# Altium schematic sheet NE-CurrentSense-V2.SchDoc: Current Sense
size A4; Organization: Altium Limited; Address1: L3, 12a Rodborough Rd; Address2: Frenchs Forest; Address3: NSW; Address4: Australia 2086; Revision: 2.0; SheetNumber: 1; SheetTotal: 1
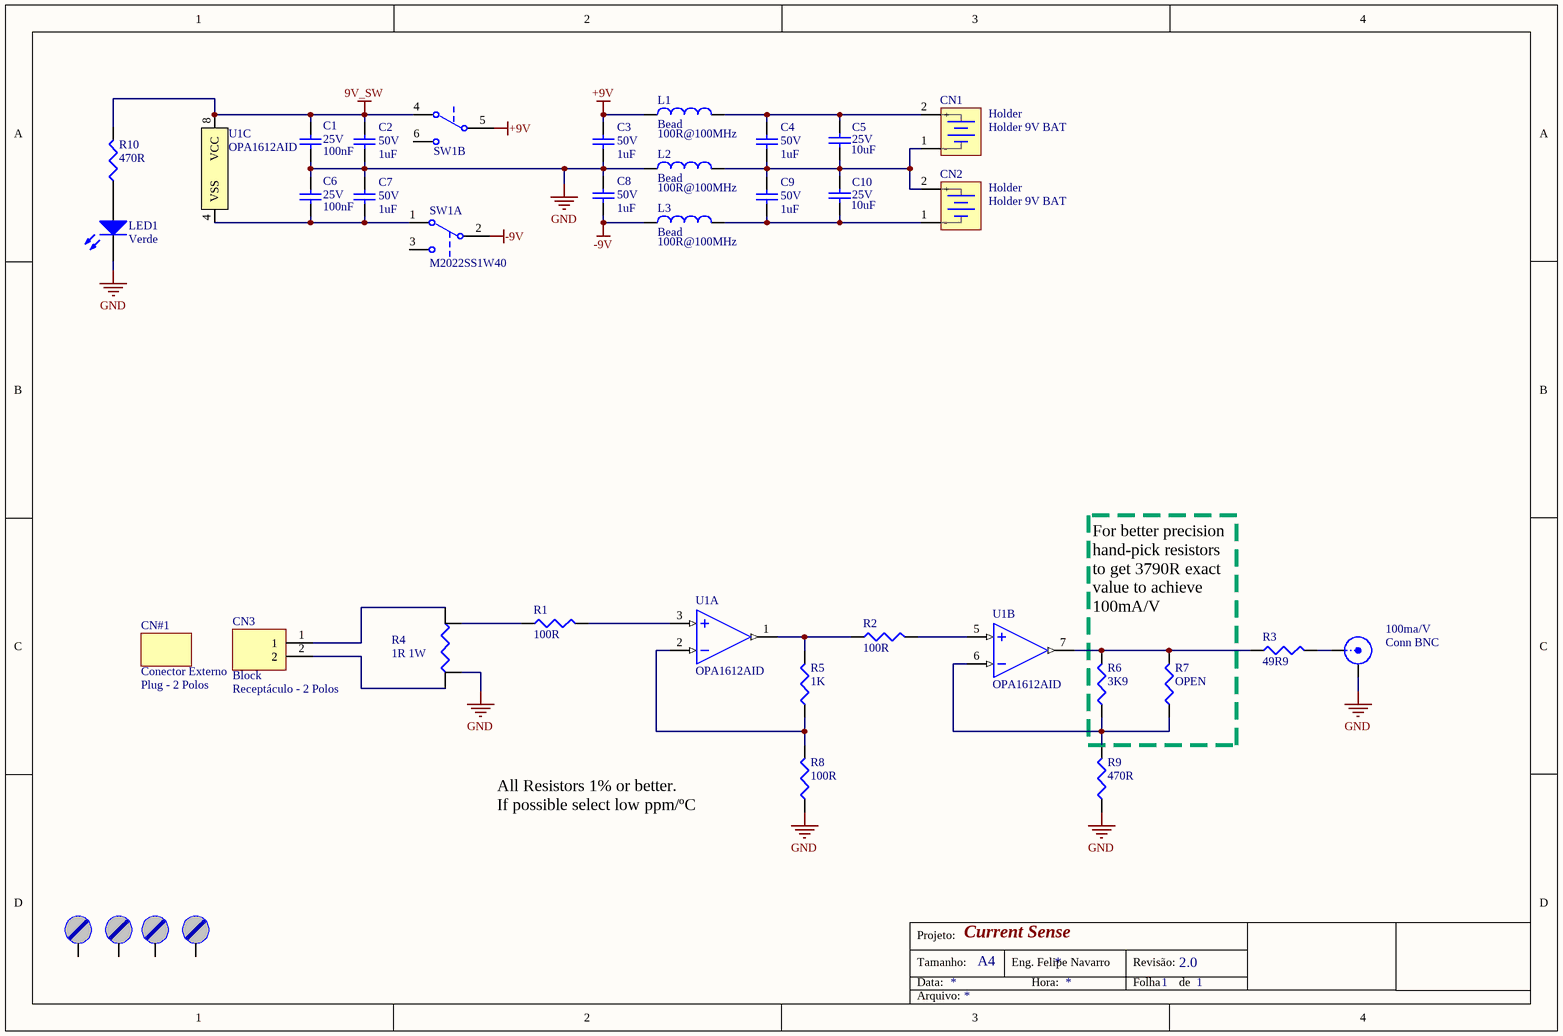
[diagram p0: NE-CurrentSense-V2.SchDoc]

## Parts
(Parts that share a designator on the sheet are numbered #1, #2 ... from top to bottom, then left to right.)
100ma/V  Conn BNC  [CONN BNC-JACK]
C1  value 100nF  Tensão: 25V  [CC0603]  (hidden comment: Capacitor Cerâmico)
C2  value 1uF  Tensão: 50V  [CC0603]  (hidden comment: Capacitor Cerâmico)
C3  value 1uF  Tensão: 50V  [CC0603]  (hidden comment: Capacitor Cerâmico)
C4  value 1uF  Tensão: 50V  [CC0603]  (hidden comment: Capacitor Cerâmico)
C5  value 10uF  Tensão: 25V  [CC0805]  (hidden comment: Capacitor Cerâmico)
C6  value 100nF  Tensão: 25V  [CC0603]  (hidden comment: Capacitor Cerâmico)
C7  value 1uF  Tensão: 50V  [CC0603]  (hidden comment: Capacitor Cerâmico)
C8  value 1uF  Tensão: 50V  [CC0603]  (hidden comment: Capacitor Cerâmico)
C9  value 1uF  Tensão: 50V  [CC0603]  (hidden comment: Capacitor Cerâmico)
C10  value 10uF  Tensão: 25V  [CC0805]  (hidden comment: Capacitor Cerâmico)
CN1  Holder  value Holder 9V BAT  [BATTHOLDER-9V-BH9V-PC-ND]
CN2  Holder  value Holder 9V BAT  [BATTHOLDER-9V-BH9V-PC-ND]
CN3  Block  value Receptáculo - 2 Polos  [CONN BLOCK2 RCPT/H]
CN#1  Conector Externo  value Plug - 2 Polos  [N/A]
HOLE3  Furo de Fixação  [Furo_M3]  (value not drawn)  (no BOM)
HOLE4#1  Furo de Fixação  [Furo_M3]  (value not drawn)  (no BOM)
HOLE4#2  Furo de Fixação  [Furo_M3]  (value not drawn)  (no BOM)
HOLE5  Furo de Fixação  [Furo_M3]  (value not drawn)  (no BOM)
L1  Bead  value 100R@100MHz  [CC0603]
L2  Bead  value 100R@100MHz  [CC0603]
L3  Bead  value 100R@100MHz  [CC0603]
LED1  value Verde  [LED-INDIC]  (hidden comment: LED)
R1  value 100R  [CC0603]  (hidden comment: Resistor)
R2  value 100R  [CC0603]  (hidden comment: Resistor)
R3  value 49R9  [CC0603]  (hidden comment: Resistor)
R4  value 1R 1W  [CC2516 - Wide Vishay]  (hidden comment: Resistor)
R5  value 1K  [CC0603]  (hidden comment: Resistor)
R6  value 3K9  [CC0603]  (hidden comment: Resistor)
R7  value OPEN  [CC0603]  (hidden comment: Resistor Open)  (no BOM)
R8  value 100R  [CC0603]  (hidden comment: Resistor)
R9  value 470R  [CC0603]  (hidden comment: Resistor)
R10  value 470R  [CC0603]  (hidden comment: Resistor)
SW1  M2022SS1W40  [SWITCH TOGGLE DPDT 6A 125V]  (parts A,B of 2)
U1  OPA1612AID  [SOIC-8N]  (parts A,B,C of 3)

## Nets
9V_SW: C1.2 C2.2 R10.2 SW1.4(NC2) U1.8(VCC)
+9V: C3.2 L1.1 SW1.5(C2)
-9V: C8.1 L3.1 SW1.2(C1)
GND: 100ma/V.2(Y) C1.1 C2.1 C3.1 C6.2 C7.2 C8.2 L2.1 LED1.2(K) R4.2 R8.1 R9.1
Net100ma/V_1: 100ma/V.1(X) R3.2
NetC4_1: C4.1 C5.1 C9.2 C10.2 CN1.1(-) CN2.2(+) L2.2
NetC4_2: C4.2 C5.2 CN1.2(+) L1.2
NetC6_1: C6.1 C7.1 SW1.1(NC1) U1.4(VSS)
NetC9_1: C9.1 C10.1 CN2.1(-) L3.2
NetCN3_1: CN3.1 R4.3
NetCN3_2: CN3.2 R4.1
NetLED1_1: LED1.1(A) R10.1
NetR1_1: R1.1 R4.4
NetR1_2: R1.2 U1.3(INA+)
NetR2_1: R2.1 R5.2 U1.1(OUTA)
NetR2_2: R2.2 U1.5(INB+)
NetR3_1: R3.1 R6.2 R7.2 U1.7(OUTB)
NetR5_1: R5.1 R8.2 U1.2(INA-)
NetR6_1: R6.1 R7.1 R9.2 U1.6(INB-)

Not connected (* = marked no-connect by the designer): HOLE3 X; HOLE4#1 X; HOLE4#2 X; HOLE5 X; SW1 3(NO1) 6(NO2)

## Notes on the sheet
- For better precision hand-pick resistors to get 3790R exact value to achieve 100mA/V
- All Resistors 1% or better.
  If possible select low ppm/ºC
- Projeto:
- Tamanho:
- Data:
- A4
- Eng. Felipe Navarro
- Hora:
- Revisão:
- Folha
- de
- Arquivo:

## Library data of the parts
100ma/V = Conn BNC: Conector BNC; ChinesePrice: 0,00000; Chinês: ----; Value: Jack BNC; Corrente: *; Potência: *; Supplier 1: Digi-Key; Supplier Part Number 1: A97570-ND; Tensão: *; Obs:: *; Tolerância: *; ComponentLink1Description: Datasheet; ComponentLink1URL: D:\Tecnoclade\Datasheet\!DataMissing.pdf
C1 C6 = Cap 100nF 25V 0603 X7R: Capacitor (Semiconductor SIM Model); Chinês: Local; ChinesePrice: 0,00246; Corrente: *A; Potência: *W; Obs:: X7R; Tolerância: ±10%; Supplier 1: Digi-Key; Supplier Part Number 1: 490-1524-1-ND; ComponentLink1Description: Datasheet; ComponentLink1URL: D:\Tecnoclade\Datasheet\!DataMissing.pdf
C2-C4 C7-C9 = Cap 1uF 50V 0603 X5R: Capacitor (Semiconductor SIM Model); Chinês: Local; ChinesePrice: 0,01100; Corrente: *A; Potência: *W; Obs:: X5R; Tolerância: ±10%; Supplier 1: Digi-Key; Supplier Part Number 1: 587-2400-1-ND; ComponentLink1Description: Datasheet; ComponentLink1URL: D:\Tecnoclade\Datasheet\!DataMissing.pdf
C5 C10 = Cap 10uF 25V 0805 X5R: Capacitor (Semiconductor SIM Model); Chinês: Local; ChinesePrice: 0,02620; Corrente: *A; Potência: *W; Obs:: X5R; Tolerância: ±10%; Supplier 1: Digi-Key; Supplier Part Number 1: 587-2985-1-ND; ComponentLink1Description: Datasheet; ComponentLink1URL: D:\Tecnoclade\Datasheet\!DataMissing.pdf
CN1 CN2 = BattHolder 9V: Corrente: *A; Chinês: ----; ChinesePrice: 0,00000; Tensão: *V; Potência: *; Supplier 1: Digi-Key; Supplier Part Number 1: BH9V-PC-ND; Obs:: *; Tolerância: *; ComponentLink1Description: Datasheet; ComponentLink1URL: D:\Tecnoclade\Datasheet\!DataMissing.pdf
CN3 = SHRD Block 2P RCPT-H P3.81mm: Conector Shrouded Block; ChinesePrice: 0,00000; Chinês: ----; Corrente: 10A; Tensão: 300V; Potência: *; Supplier 1: Digi-Key; Supplier Part Number 1: ED2808-ND; Obs:: *; Tolerância: *; ComponentLink1Description: Datasheet; ComponentLink1URL: D:\Tecnoclade\Datasheet\!DataMissing.pdf
CN#1 = Plug Block 2P 3.81mm: Conector Plug; Corrente: 10A; Tensão: 300V; Chinês: ----; ChinesePrice: 0,00000; Tolerância: 16~26 AWG; Supplier 1: Digi-Key; Supplier Part Number 1: ED2875-ND; Potência: *; Obs:: *; ComponentLink1Description: Datasheet; ComponentLink1URL: D:\Tecnoclade\Datasheet\!DataMissing.pdf
HOLE3 HOLE4#1 HOLE4#2 HOLE5 = Parafuso: Furo para parafuso; Value: M3; ChinesePrice: 0,00000; Chinês: ----; Corrente: *; Potência: *; Supplier 1: Digi-Key; Supplier Part Number 1: --Del; Tensão: *; Obs:: *; Tolerância: *; ComponentLink1Description: Datasheet; ComponentLink1URL: D:\Tecnoclade\Datasheet\!DataMissing.pdf
L1-L3 = Bd 100R@100MHz 0603 2A: ChinesePrice: 0,00000; Chinês: ----; Obs:: Ferrite (0R04); Tolerância: ±25%; Corrente: 2A; Potência: *; Supplier 1: Digi-Key; Supplier Part Number 1: 445-2984-1-ND; Tensão: *; ComponentLink1Description: Datasheet; ComponentLink1URL: D:\Tecnoclade\Datasheet\!DataMissing.pdf; Substituição: 00/00/0000
LED1 = LED2: Typical RED, GREEN, YELLOW, AMBER GaAs LED; ChinesePrice: 0,00000; Chinês: ----; VertSimCode: } XXXXX {; Supplier 1: Digi-Key; Supplier Part Number 1: 754-1297-ND
R1 R2 R8 = Res 100R 5% 0603 1/10W: ChinesePrice: 0,00080; Chinês: Local; Corrente: *A; Potência: 1/10W; Tensão: *V; Tolerância: ±5%; Supplier 1: Digi-Key; Supplier Part Number 1: RMCF0603JT100RCT-ND; Obs: *; ComponentLink1Description: Datasheet; ComponentLink1URL: D:\Tecnoclade\Datasheet\!DataMissing.pdf
R3 = Res 49R9 1% 0603 1/10W: ChinesePrice: 0,00089; Chinês: Local; Corrente: *A; Potência: 1/10W; Tensão: *V; Tolerância: ±1%; Supplier 1: Digi-Key; Supplier Part Number 1: P49.9HCT-ND; Obs: *; ComponentLink1Description: Datasheet; ComponentLink1URL: D:\Tecnoclade\Datasheet\!DataMissing.pdf
R4 = Res 1R 0.1% CC2516-Wide-4W 1W: ChinesePrice: 0,00000; Chinês: ----; Corrente: *A; Potência: 1/10W; Tensão: *V; Tolerância: ±*%; Obs:: *; ComponentLink1Description: Datasheet; ComponentLink1URL: D:\Tecnoclade\Datasheet\!DataMissing.pdf; Supplier 1: Digi-Key; Supplier Part Number 1: Y1606-1.0B-ND
R5 = Res 1K 0.1% 0603 1/16W: ChinesePrice: 0,00000; Chinês: ----; Corrente: *A; Potência: 1/16W; Tensão: *V; Obs: ±25ppm/ºC; Tolerância: ±0.1%; Supplier 1: Digi-Key; Supplier Part Number 1: A102332CT-ND; ComponentLink1Description: Datasheet; ComponentLink1URL: D:\Tecnoclade\Datasheet\!DataMissing.pdf
R6 = Res 3K9 1% 0603 1/10W: ChinesePrice: 0,00000; Chinês: ----; Corrente: *A; Potência: 1/10W; Tensão: *V; Obs: ±100ppm/ºC; Tolerância: ±1%; Supplier 1: Digi-Key; Supplier Part Number 1: 311-3.90KHRCT-ND; ComponentLink1Description: Datasheet; ComponentLink1URL: D:\Tecnoclade\Datasheet\!DataMissing.pdf
R7 = Res Open 0603: Resistor; ChinesePrice: 0,00000; Chinês: ----; Corrente: *A; Potência: *W; Tensão: *V; Tolerância: ±*%; Supplier 1: Digi-Key; Supplier Part Number 1: --Del; Obs:: *; ComponentLink1Description: Datasheet; ComponentLink1URL: D:\Tecnoclade\Datasheet\!DataMissing.pdf
R9 R10 = Res 470R 5% 0603 1/10W: ChinesePrice: 0,00000; Chinês: ----; Corrente: *A; Potência: 1/10W; Tensão: *V; Obs: ±200ppm/ºC; Tolerância: ±5%; Supplier 1: Digi-Key; Supplier Part Number 1: RMCF0603JT470RCT-ND; ComponentLink1Description: Datasheet; ComponentLink1URL: D:\Tecnoclade\Datasheet\!DataMissing.pdf
SW1 = SW-DPDT: Double-Pole, Double-Throw Switch; ChinesePrice: 1,64000; Chinês: Local; Corrente: 6A; Tensão: 125V; Value: ON-ON; Potência: *; Supplier 1: Digi-Key; Supplier Part Number 1: M2022SS1W40-ND; Obs:: *; Tolerância: *; ComponentLink1Description: Datasheet; ComponentLink1URL: D:\Tecnoclade\Datasheet\
U1 = OPA2197: OPAx197 36-V, Precision, Rail-to-Rail Input/Output, Low Offset Voltage, Operational Amplifiers; Chinês: ----; ChinesePrice: 0,00000; Tensão: 36V; Value: 10MHz; Corrente: 65mA; Potência: *; Supplier 1: Digi-Key; Supplier Part Number 1: 296-24959-5-ND; Obs:: Rail-To-Rail; Tolerância: *; ComponentLink1Description: Datasheet; ComponentLink1URL: D:\Tecnoclade\Datasheet\